# EAGLE design R401H (EAGLE 6.6.0)
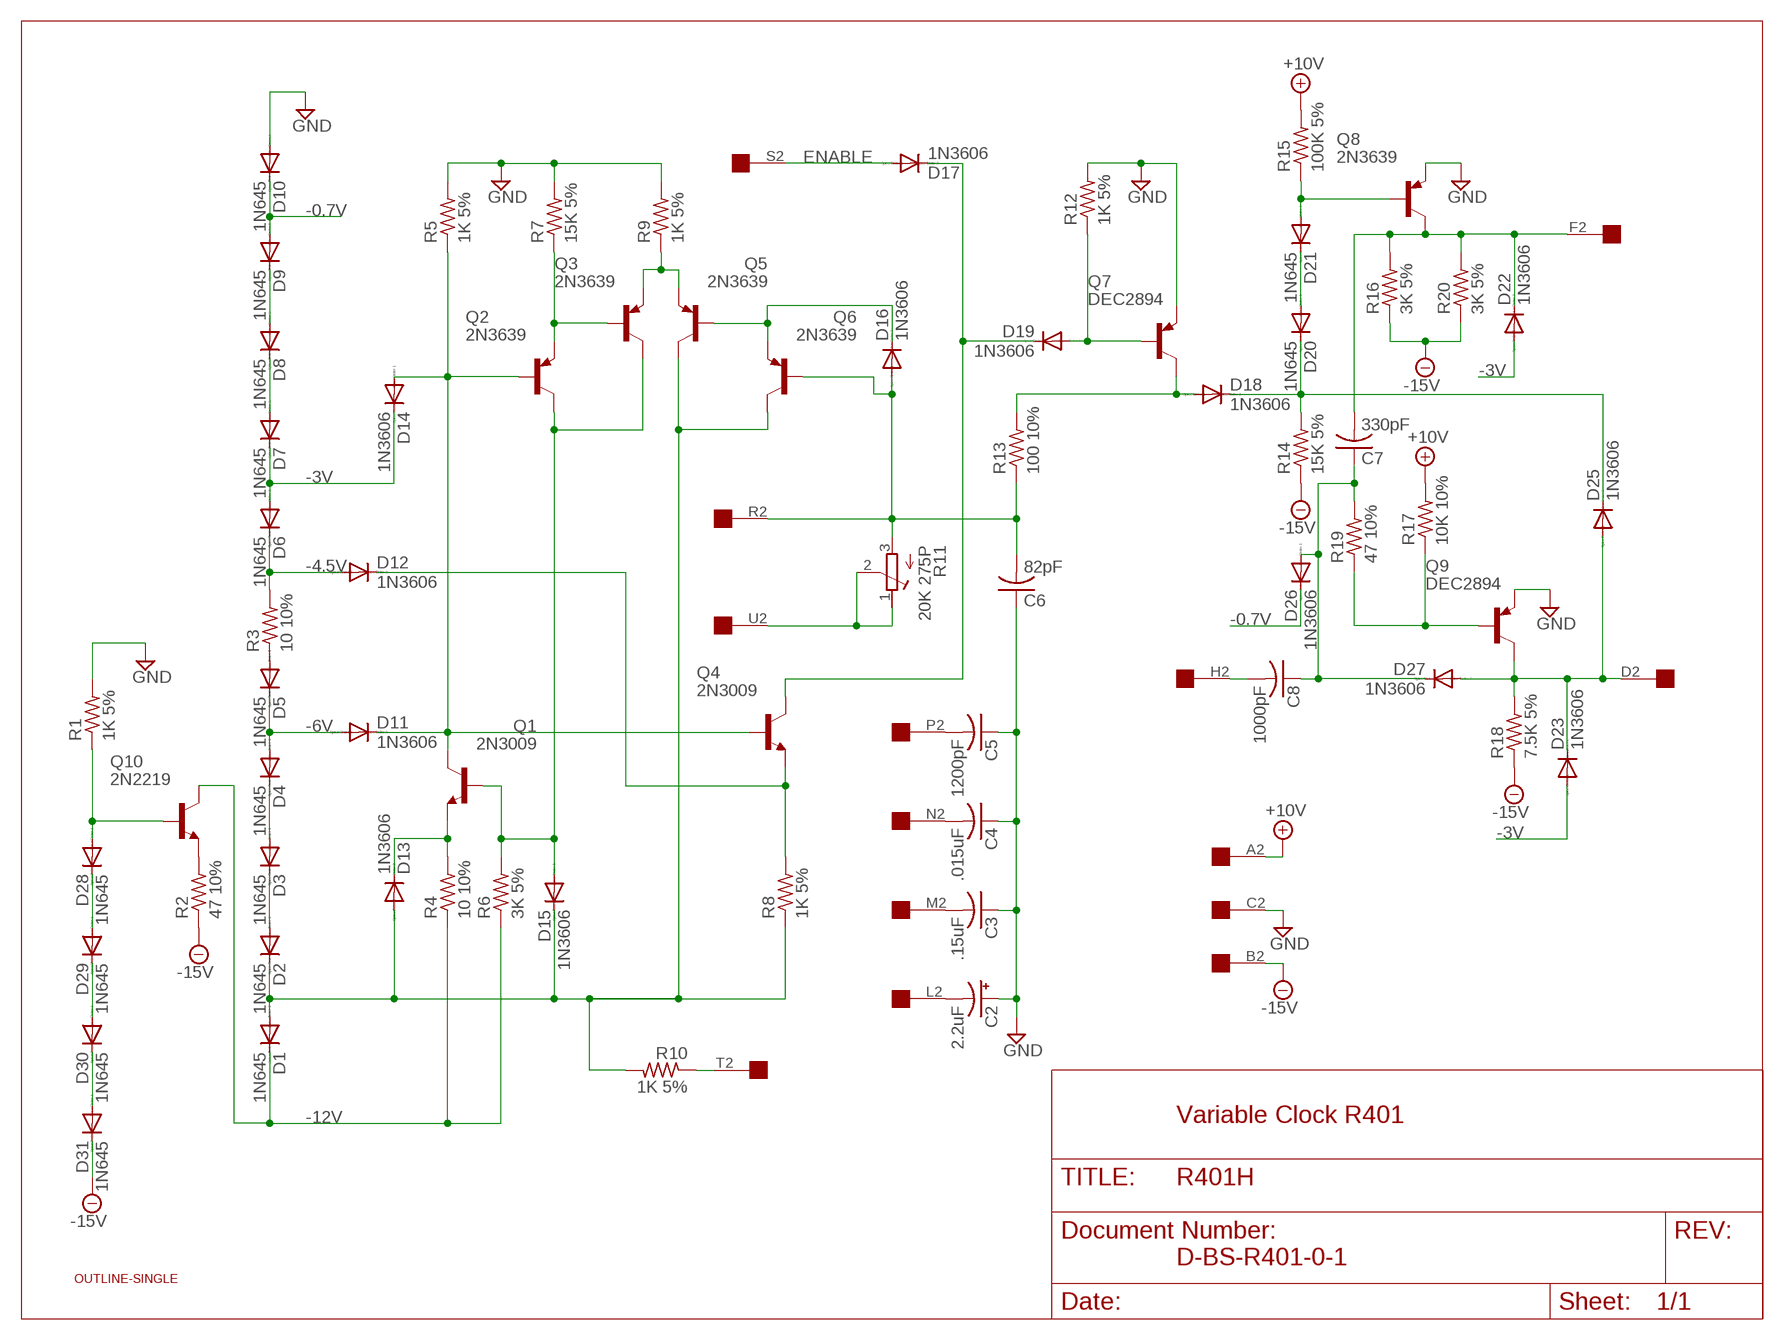
[diagram p0: schematic, sheet 1]

## Parts
C2  2.2uF  CPOL-USE12-4AXIAL  [E12-4]
C3  .15uF  C-US225-062X268  [C225-062X268]
C4  .015uF  C-US102-043X133  [C102-043X133]
C5  1200pF  C-US150-054X183  [C150-054X183]
C6  82pF  C-US102-043X133  [C102-043X133]
C7  330pF  C-US150-054X183  [C150-054X183]
C8  1000pF  C-US150-054X183  [C150-054X183]
D1  1N645  1N4148DO35-10  [DO35-10]
D2  1N645  1N4148DO35-10  [DO35-10]
D3  1N645  1N4148DO35-10  [DO35-10]
D4  1N645  1N4148DO35-10  [DO35-10]
D5  1N645  1N4148DO35-10  [DO35-10]
D6  1N645  1N4148DO35-10  [DO35-10]
D7  1N645  1N4148DO35-10  [DO35-10]
D8  1N645  1N4148DO35-10  [DO35-10]
D9  1N645  1N4148DO35-10  [DO35-10]
D10  1N645  1N4148DO35-10  [DO35-10]
D11  1N3606  1N4148DO35-10  [DO35-10]
D12  1N3606  1N4148DO35-10  [DO35-10]
D13  1N3606  1N4148DO35-10  [DO35-10]
D14  1N3606  1N4148DO35-10  [DO35-10]
D15  1N3606  1N4148DO35-10  [DO35-10]
D16  1N3606  1N4148DO35-10  [DO35-10]
D17  1N3606  1N4148DO35-10  [DO35-10]
D18  1N3606  1N4148DO35-10  [DO35-10]
D19  1N3606  1N4148DO35-10  [DO35-10]
D20  1N645  1N4148DO35-10  [DO35-10]
D21  1N645  1N4148DO35-10  [DO35-10]
D22  1N3606  1N4148DO35-10  [DO35-10]
D23  1N3606  1N4148DO35-10  [DO35-10]
D25  1N3606  1N4148DO35-10  [DO35-10]
D26  1N3606  1N4148DO35-10  [DO35-10]
D27  1N3606  1N4148DO35-10  [DO35-10]
D28  1N645  1N4148DO35-10  [DO35-10]
D29  1N645  1N4148DO35-10  [DO35-10]
D30  1N645  1N4148DO35-10  [DO35-10]
D31  1N645  1N4148DO35-10  [DO35-10]
Q1  2N3009  2N2102  [TO5]
Q2  2N3639  2N2904  [TO39]
Q3  2N3639  2N2904  [TO39]
Q4  2N3009  2N2102  [TO5]
Q5  2N3639  2N2904  [TO39]
Q6  2N3639  2N2904  [TO39]
Q7  DEC2894  2N2904  [TO39]
Q8  2N3639  2N2904  [TO39]
Q9  DEC2894  2N2904  [TO39]
Q10  2N2219  2N2102  [TO5]
R1  1K 5%  R-US_0207/10  [0207/10]
R2  47 10%  R-US_0207/10  [0207/10]
R3  10 10%  R-US_0207/10  [0207/10]
R4  10 10%  R-US_0207/10  [0207/10]
R5  1K 5%  R-US_0207/10  [0207/10]
R6  3K 5%  R-US_0207/10  [0207/10]
R7  15K 5%  R-US_0207/10  [0207/10]
R8  1K 5%  R-US_0207/10  [0207/10]
R9  1K 5%  R-US_0207/10  [0207/10]
R10  1K 5%  R-US_0207/10  [0207/10]
R11  20K 275P  275P  [3006Y]
R12  1K 5%  R-US_0207/10  [0207/10]
R13  100 10%  R-US_0207/10  [0207/10]
R14  15K 5%  R-US_0207/10  [0207/10]
R15  100K 5%  R-US_0207/10  [0207/10]
R16  3K 5%  R-US_0207/10  [0207/10]
R17  10K 10%  R-US_0207/10  [0207/10]
R18  7.5K 5%  R-US_0207/10  [0207/10]
R19  47 10%  R-US_0207/10  [0207/10]
R20  3K 5%  R-US_0207/10  [0207/10]
U$1  OUTLINE-SINGLE  [SINGLE]
U$2  EDGE-1  [EDGE-CON1]

## Nets
+10V [Supply]: R15.2 R17.2 U$2.A2
-0.7V [Supply]: D9.A D10.C D26.C
-3V [Supply]: D6.A D7.C D14.C D22.A D23.A
-4.5V [Supply]: D6.C D12.A R3.2
-6V [Supply]: D4.A D5.C D11.A
-12V [Supply]: D1.C Q10.3(C) R4.1 R6.1
-15V [Supply]: D31.C R2.1 R14.1 R16.1 R18.1 R20.1 U$2.B2
ENABLE: D17.A U$2.S2
GND [Supply]: C2.+ C3.1 C4.1 C5.1 C6.1 D10.A Q7.1(E) Q8.1(E) Q9.1(E) R1.2 R5.2 R7.2 R9.2 R12.2 U$2.C2
N$1: D28.C D29.A
N$2: D30.C D31.A
N$3: D29.C D30.A
N$4: D28.A Q10.2(B) R1.1
N$5: Q10.1(E) R2.2
N$6: D5.A R3.1
N$7: D11.C D14.A Q1.3(C) Q2.2(B) Q4.2(B) R5.1
N$8 [Supply]: D8.A D9.C
N$9 [Supply]: D7.A D8.C
N$10: D13.C Q1.1(E) R4.2
N$11: D15.A Q1.2(B) Q2.3(C) Q3.3(C) R6.2
N$12 [Supply]: D1.A D2.C D13.A D15.C Q5.3(C) Q6.3(C) R8.1 R10.2
N$13 [Supply]: D2.A D3.C
N$14 [Supply]: D3.A D4.C
N$15: Q2.1(E) Q3.2(B) R7.1
N$16: Q3.1(E) Q5.1(E) R9.1
N$17: D12.C Q4.1(E) R8.2
N$18: D16.C Q5.2(B) Q6.1(E)
N$19: C6.2 D16.A Q6.2(B) R11.3(E) R13.1 U$2.R2
N$20: R11.1(A) R11.2(S) U$2.U2
N$21: D19.A Q7.2(B) R12.1
N$22: D17.C D19.C Q4.3(C)
N$23: D18.A Q7.3(C) R13.2
N$24: C4.2 U$2.N2
N$25: D23.C D25.A D27.A Q9.3(C) R18.2 U$2.D2
N$26: C3.2 U$2.M2
N$27: C2.- U$2.L2
N$28: C5.2 U$2.P2
N$29: D21.A Q8.2(B) R15.1
N$30: D20.A D21.C
N$32: C7.2 D22.C Q8.3(C) R16.2 R20.2 U$2.F2
N$33: D18.C D20.C D25.C R14.2
N$34: Q9.2(B) R17.1 R19.1
N$35: C7.1 C8.1 D26.A D27.C R19.2
N$36: C8.2 U$2.H2
N$37: R10.1 U$2.T2
Unconnected: U$2.E2 U$2.J2 U$2.K2 U$2.V2

## Notes on the sheet
- Variable Clock R401
- D-BS-R401-0-1

## Library data of the parts
C2 = dec-con:CPOL-USE12-4AXIAL: 0.5" veresion of an electrolytic
C3-C8 = rcl:C-US: CAPACITOR, American symbol
D1-D23 D25-D31 = diode:1N4148: DIODE high speed (Philips)
Q1 Q4 Q10 = transistor-npn:2N2102: NPN Transistor
Q2 Q3 Q5-Q9 = transistor-pnp:2N2904*: PNP Transistror
R1-R10 R12-R20 = rcl:R-US_: RESISTOR, American symbol
R11 = dec-con:275P: Trimpot with 275P (3006Y) footprint.
U$1 = dec-con:OUTLINE-*: Board outlines for DEC boards.
U$2 = dec-con:EDGE-1: Single-Sided DEC Edge Connector -- (side 2)

## Net classes
1 Supply: width 0.813 mm

## Board
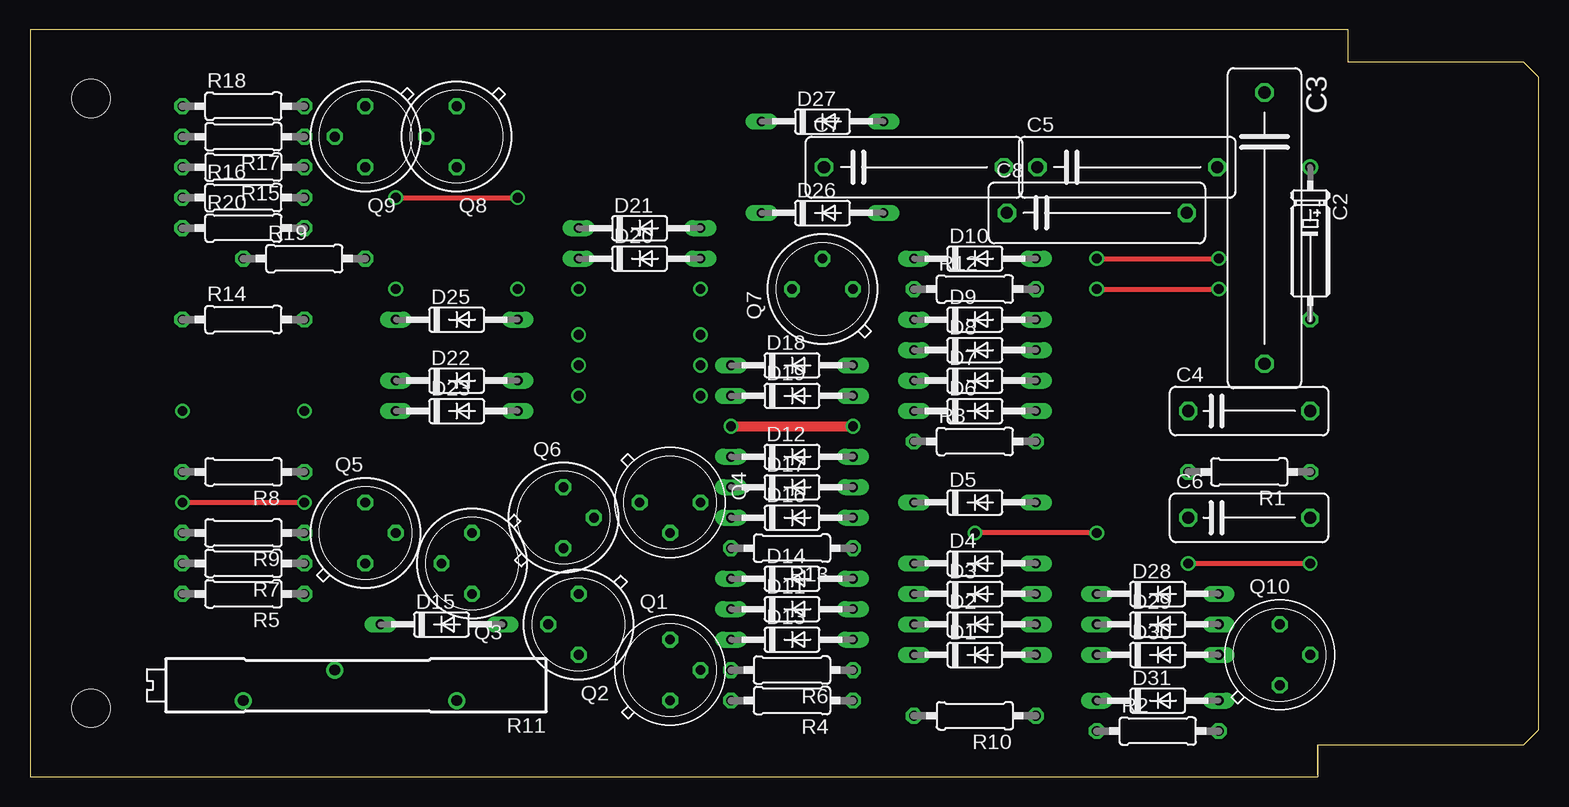
[diagram p1: board, top side]
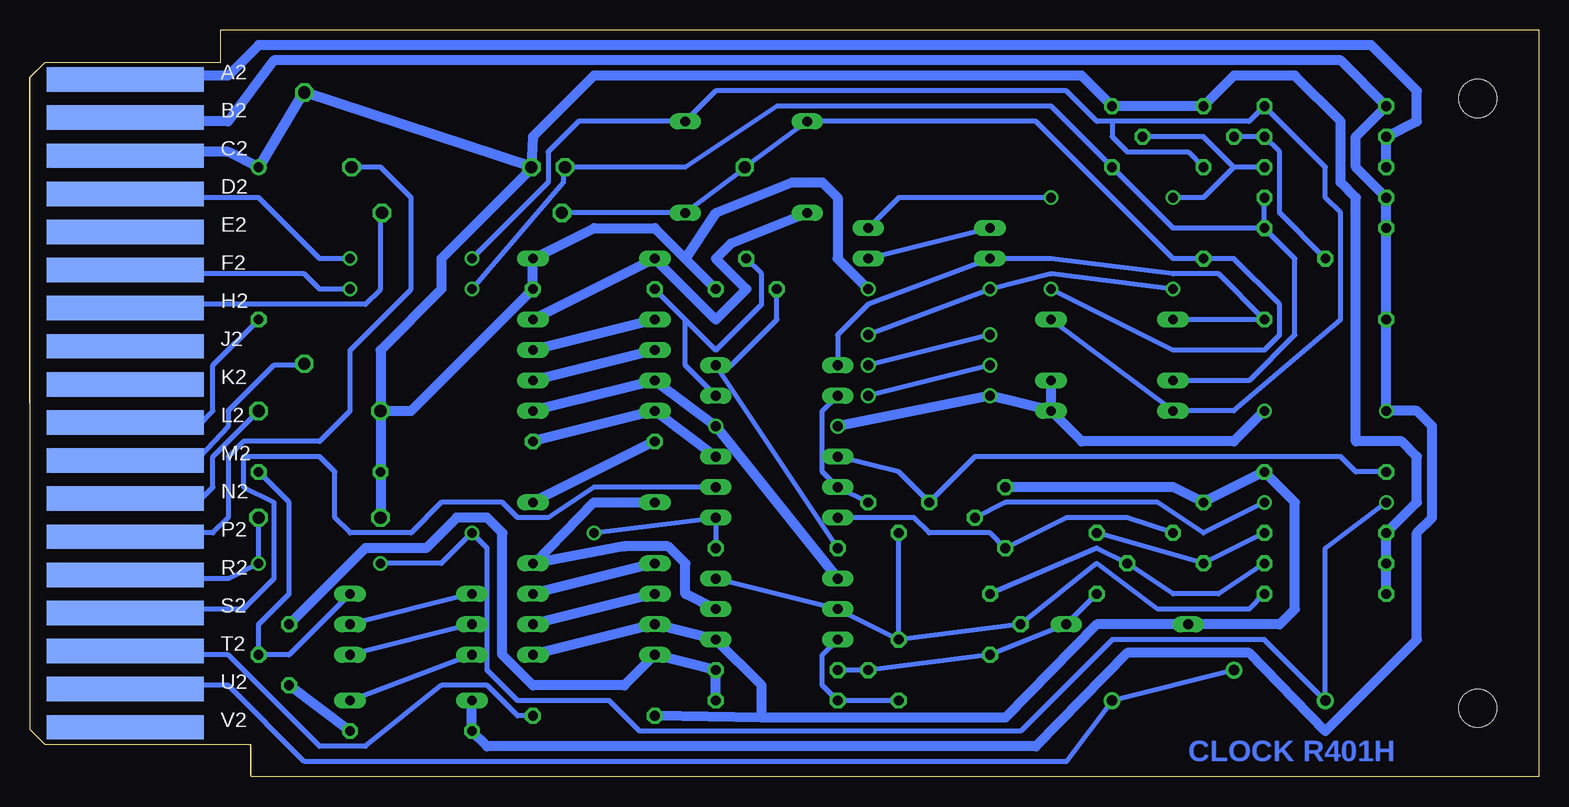
[diagram p2: board, bottom side, seen from below]

Size 125.73 x 62.23 mm. Coordinates in mm from the lower left corner, seen from the top.
Copper layers (1+16): Top 0.035mm / dielectric 1.5mm / Bottom 0.035mm
Design rules "16mils": minimum track width 16mil, minimum drill 32mil, track to track 15mil, track to pad 10mil, pad to pad 10mil, via to via 10mil, smd to smd 10mil, copper to edge 13mil, drill to drill 10mil, minimum pad ring 10mil, minimum via ring 8mil, stop-mask expansion 0mil, vias tented up to drill 0mil, thermal gap 10mil

### Footprints (pad centres in the part's own frame; a part is rotated, then mirrored left to right if it is on the bottom)
E12-4 = drill 0.813: + -7.62,0 | drill 0.813 octagon: - 5.08,0
C225-062X268 = drill 1.016 octagon: 1 -11.303,0; 2 11.303,0
C102-043X133 = drill 1.016 octagon: 1 -5.08,0; 2 5.08,0
C150-054X183 = drill 1.016 octagon: 1 -7.493,0; 2 7.493,0
DO35-10 = drill 0.813 long: A 5.08,0; C -5.08,0
TO5 = drill 0.813 octagon: 1 0,-2.54; 2 2.54,0; 3 0,2.54
TO39 = drill 0.813 octagon: 1 0,-2.54; 2 2.54,0; 3 0,2.54
0207/10 = drill 0.813 octagon: 1 -5.08,0; 2 5.08,0
3006Y = drill 0.9: 1 -8.89,1.27; 2 1.27,-1.27; 3 8.89,1.27
SINGLE = hole 3.175: 120.65,56.515; 120.65,5.715
EDGE-CON1 = smd 13.106 x 2.032 bottom: A2 7.938,4.128; B2 7.938,7.303; C2 7.938,10.477; D2 7.938,13.652; E2 7.938,16.828; F2 7.938,20.003; H2 7.938,23.177; J2 7.938,26.352; K2 7.938,29.527; L2 7.938,32.703; M2 7.938,35.877; N2 7.938,39.053; P2 7.938,42.227; R2 7.938,45.403; S2 7.938,48.578; T2 7.938,51.752; U2 7.938,54.928; V2 7.938,58.102

### Placement (x,y rotation side)
C2  106.68,43.18 270 top
C3  102.87,45.72 270 top
C4  101.6,30.48 0 top
C5  91.44,50.8 0 top
C6  101.6,21.59 0 top
C7  73.66,50.8 0 top
C8  88.9,46.99 0 top
D1  78.74,10.16 0 top
D2  78.74,12.7 0 top
D3  78.74,15.24 0 top
D4  78.74,17.78 0 top
D5  78.74,22.86 0 top
D6  78.74,30.48 0 top
D7  78.74,33.02 0 top
D8  78.74,35.56 0 top
D9  78.74,38.1 0 top
D10  78.74,43.18 0 top
D11  63.5,13.97 0 top
D12  63.5,26.67 0 top
D13  63.5,11.43 0 top
D14  63.5,16.51 0 top
D15  34.29,12.7 0 top
D16  63.5,21.59 0 top
D17  63.5,24.13 0 top
D18  63.5,34.29 0 top
D19  63.5,31.75 0 top
D20  50.8,43.18 0 top
D21  50.8,45.72 0 top
D22  35.56,33.02 0 top
D23  35.56,30.48 0 top
D25  35.56,38.1 0 top
D26  66.04,46.99 0 top
D27  66.04,54.61 0 top
D28  93.98,15.24 0 top
D29  93.98,12.7 0 top
D30  93.98,10.16 0 top
D31  93.98,6.35 0 top
Q1  53.34,8.89 0 top
Q2  45.72,12.7 180 top
Q3  36.83,17.78 180 top
Q4  53.34,22.86 270 top
Q5  27.94,20.32 0 top
Q6  44.45,21.59 0 top
Q7  66.04,40.64 90 top
Q8  35.56,53.34 180 top
Q9  27.94,53.34 180 top
Q10  104.14,10.16 0 top
R1  101.6,25.4 180 top
R2  93.98,3.81 0 top
R3  78.74,27.94 0 top
R4  63.5,6.35 180 top
R5  17.78,15.24 180 top
R6  63.5,8.89 180 top
R7  17.78,17.78 180 top
R8  17.78,25.4 180 top
R9  17.78,20.32 180 top
R10  78.74,5.08 180 top
R11  26.67,7.62 180 top
R12  78.74,40.64 0 top
R13  63.5,19.05 180 top
R14  17.78,38.1 0 top
R15  17.78,50.8 180 top
R16  17.78,48.26 0 top
R17  17.78,53.34 180 top
R18  17.78,55.88 0 top
R19  22.86,43.18 0 top
R20  17.78,45.72 0 top
U$1  125.73,62.23 180 top
U$2  125.73,62.23 180 top

### Tracks (layer width: path | path; a pad name or v marks a point on that pad's centre or on a via)
+10V
  Bottom 0.813: U$2.A2 116.84,58.04 116.84,58.42 109.22,58.42 106.68,60.96 13.97,60.96 10.16,57.15 10.16,54.61 R17.2 R15.2
-0.7V
  Bottom 0.813: D9.A D10.C 68.58,38.1 66.04,40.64 68.58,43.18 67.31,44.45 D26.C
-3V  (via drill 0.81)
  Top 0.813: v58.42,29.21 v68.58,29.21
  Bottom 0.813: D6.A D7.C v68.58,29.21 D14.C | D23.A v45.72,31.75 v58.42,29.21 | D23.A D22.A | D23.A 38.1,27.94 25.4,27.94 v22.86,30.48
-4.5V
  Bottom 0.813: R3.2 D6.C D12.A
-6V
  Bottom 0.813: D5.C 78.74,22.86 83.66,17.78 | 83.66,17.78 D4.A | D11.A 71.12,15.24 71.12,17.78 72.55,19.21 76.2,19.21 83.66,17.78
-12V
  Bottom 0.813: R4.1 R6.1 D1.C 76.2,7.62 83.82,7.62 86.36,10.16 86.36,20.32 87.63,21.59 90.17,21.59 92.71,19.05 97.79,19.05 Q10.3
-15V  (via drill 0.81)
  Bottom 0.813: U$2.B2 116.84,54.61 109.22,54.61 105.41,59.69 16.51,59.69 R18.1 15.24,53.34 15.24,50.8 R16.1 R20.1 R14.1 v12.7,30.48 10.16,30.48 8.89,29.21 8.89,21.59 10.16,20.32 10.16,11.43 17.78,3.81 24.13,10.32 34.29,10.32 41.91,2.54 87.63,2.54 R2.1 D31.C
ENABLE
  Bottom 0.406: U$2.S2 116.84,13.97 107.95,13.97 105.41,16.51 105.41,22.86 107.95,24.13 107.95,26.67 101.6,26.67 100.33,25.4 100.33,21.59 99.06,20.32 93.98,20.32 91.44,22.86 86.36,22.86 85.09,21.59 82.55,21.59 78.74,24.13 D17.A
GND  (via drill 0.81)
  Bottom 0.813: U$2.C2 116.84,52.07 109.22,52.07 C2.+ 102.87,57.15 C3.1 83.82,50.8 | 83.82,50.8 C5.1 83.82,53.34 78.74,58.42 38.1,58.42 Q8.1 Q9.1 25.4,58.42 20.32,58.42 16.51,54.61 16.51,49.53 15.24,48.26 15.24,27.94 11.43,27.94 10.16,26.67 10.16,22.86 R9.2 R7.2 R5.2 | C4.1 93.98,30.48 R12.2 D10.A 78.74,45.72 73.66,45.72 71.12,43.18 | 83.82,50.8 91.44,43.18 91.44,40.64 96.52,35.56 C4.1 | C4.1 R1.2 C6.1 | 71.12,43.18 Q7.1 | 71.12,43.18 68.58,46.99 62.23,49.53 59.69,49.53 58.42,48.26 58.42,43.18 v55.88,40.64
N$1
  Bottom 0.406: D28.C D29.A
N$2
  Bottom 0.406: D30.C D31.A
N$3
  Bottom 0.406: D29.C D30.A
N$4
  Bottom 0.406: D28.A 104.14,10.16 Q10.2 106.68,12.7 104.14,15.24 104.14,22.86 R1.1
N$5
  Bottom 0.813: R2.2 Q10.1
N$6
  Bottom 0.813: R3.1 D5.A
N$7
  Bottom 0.406: D14.A D11.C Q1.3 | Q1.3 Q4.2 | Q1.3 Q2.2 36.83,17.78 31.75,13.97 24.13,13.97 R5.1
N$8
  Bottom 0.813: D9.C D8.A
N$9
  Bottom 0.813: D8.C D7.A
N$10
  Bottom 0.406: Q1.1 R4.2 59.69,7.62 59.69,10.16 D13.C
N$11
  Bottom 0.406: R6.2 Q1.2 Q2.3 D15.A Q3.3
N$12
  Bottom 0.813: D1.A D2.C D13.A 64.77,7.62 64.77,4.92 | Q6.3 30.48,24.13 Q5.3 R8.1 20.32,22.86 20.32,13.97 21.59,12.7 D15.C 36.83,12.7 44.45,4.92 64.77,4.92 | 64.77,4.92 R10.2
N$13
  Bottom 0.813: D3.C D2.A
N$14
  Bottom 0.813: D4.C D3.A
N$15
  Bottom 0.406: R7.1 26.67,15.24 30.48,15.24 Q3.2 36.83,19.05 Q2.1
N$16
  Bottom 0.406: R9.1 Q5.1 Q3.1
N$17
  Bottom 0.406: R8.2 15.24,25.4 16.51,26.67 46.99,26.67 Q4.1 53.34,25.4 D12.C
N$18
  Bottom 0.406: D16.C 52.07,21.59 50.8,20.32 45.72,20.32 Q6.1 39.37,21.59 34.29,21.59 Q5.2
N$19  (via drill 0.81)
  Top 0.406: v96.52,17.78 v106.68,17.78 | v88.9,20.32 v78.74,20.32 | v12.7,22.86 v22.86,22.86
  Bottom 0.406: U$2.R2 116.84,16.51 109.22,16.51 v106.68,17.78 C6.2 | v96.52,17.78 91.44,17.78 v88.9,20.32 87.63,19.05 87.63,8.89 85.09,6.35 77.47,6.35 74.93,3.81 43.18,3.81 35.56,11.43 22.86,11.43 R11.3 17.78,19.05 v12.7,22.86 | v78.74,20.32 D16.A R13.1 | v22.86,22.86 27.94,20.32 31.75,22.86 44.45,22.86 Q6.2
N$20
  Bottom 0.406: R11.2 R11.1 39.37,1.27 102.87,1.27 109.22,7.62 116.84,7.62 U$2.U2
N$21
  Bottom 0.406: D19.A 71.12,34.29 71.12,38.1 | 71.12,38.1 R12.1 | Q7.2 64.77,41.91 64.77,39.37 68.58,35.56 71.12,38.1
N$22
  Bottom 0.406: Q4.3 D17.C 59.69,25.4 59.69,30.48 D19.C
N$23
  Bottom 0.406: Q7.3 63.5,38.1 67.31,34.29 D18.A R13.2
N$24
  Bottom 0.406: U$2.N2 116.84,22.86 111.76,22.86 110.49,24.13 110.49,26.67 C4.2
N$25  (via drill 0.81)
  Top 0.406: v88.9,43.18 v99.06,43.18
  Bottom 0.406: U$2.D2 118.11,48.26 106.68,48.26 101.6,43.18 v99.06,43.18 | v88.9,43.18 82.55,49.53 82.55,52.07 80.01,54.61 D27.A 68.58,57.15 39.37,57.15 36.83,54.61 35.56,54.61 | 35.56,54.61 24.13,54.61 R18.2 17.78,50.8 17.78,48.26 16.51,46.99 16.51,38.1 25.4,30.48 D23.C D25.A | Q9.3 29.21,52.07 34.29,52.07 35.56,53.34 35.56,54.61
N$26
  Bottom 0.406: U$2.M2 116.84,26.67 111.6,26.67 109.22,29.21 109.22,30.48 105.41,34.29 102.87,34.29 C3.2
N$27
  Bottom 0.406: U$2.L2 116.84,29.21 111.76,29.21 110.49,30.48 110.49,34.29 C2.-
N$28
  Bottom 0.406: U$2.P2 116.84,20.32 110.49,20.32 109.22,21.59 109.22,26.67 107.95,27.94 101.6,27.94 99.06,30.48 99.06,35.56 93.98,40.64 93.98,48.26 96.52,50.8 C5.2
N$29  (via drill 0.81)
  Top 0.406: v30.48,48.26 v40.64,48.26
  Bottom 0.406: Q8.2 27.94,53.34 25.4,50.8 | R15.1 25.4,50.8 | 25.4,50.8 27.94,48.26 v30.48,48.26 | v40.64,48.26 53.34,48.26 D21.A
N$30
  Bottom 0.406: D21.C D20.A
N$31  (via drill 0.81)
  Bottom 0.406: v45.72,36.83 v55.88,34.29
N$32  (via drill 0.81)
  Top 0.406: v88.9,40.64 v99.06,40.64
  Bottom 0.406: U$2.F2 116.84,41.91 102.87,41.91 101.6,40.64 v99.06,40.64 | 81.28,50.8 C7.2 | v88.9,40.64 81.28,49.53 81.28,50.8 | R20.2 R16.2 | R20.2 30.48,45.72 Q8.3 40.64,55.88 63.5,55.88 71.12,50.8 81.28,50.8 | D22.C 24.13,33.02 20.32,36.83 20.32,43.18 R20.2
N$33
  Bottom 0.406: D18.C 58.42,36.83 55.88,39.37 D20.C 40.64,43.18 30.48,41.91 26.67,41.91 R14.2 D25.C
N$34
  Bottom 0.406: Q9.2 R17.1 21.59,52.07 21.59,46.99 R19.1
N$35  (via drill 0.81)
  Bottom 0.406: C8.1 D26.A 66.04,50.8 C7.1 D27.C 41.91,54.61 30.48,43.18 R19.2 25.4,43.18 21.59,39.37 21.59,36.83 22.86,35.56 30.48,35.56 v40.64,40.64
N$36
  Bottom 0.406: U$2.H2 116.84,39.37 97.79,39.37 96.52,40.64 96.52,46.99 C8.2
N$37
  Bottom 0.406: U$2.T2 116.84,10.16 109.22,10.16 101.6,2.54 97.79,2.54 91.44,7.62 87.63,7.62 85.09,5.08 R10.1
N$38  (via drill 0.81)
  Bottom 0.406: v45.72,34.29 v55.88,31.75
N$42  (via drill 0.81)
  Bottom 0.406: v55.88,36.83 v45.72,40.64 40.64,41.91 v30.48,40.64

### Text on the board
Bottom: CLOCK R401H